# Altium schematic sheet triac.SchDoc
size A4; SheetNumber: 2; SheetTotal: 3
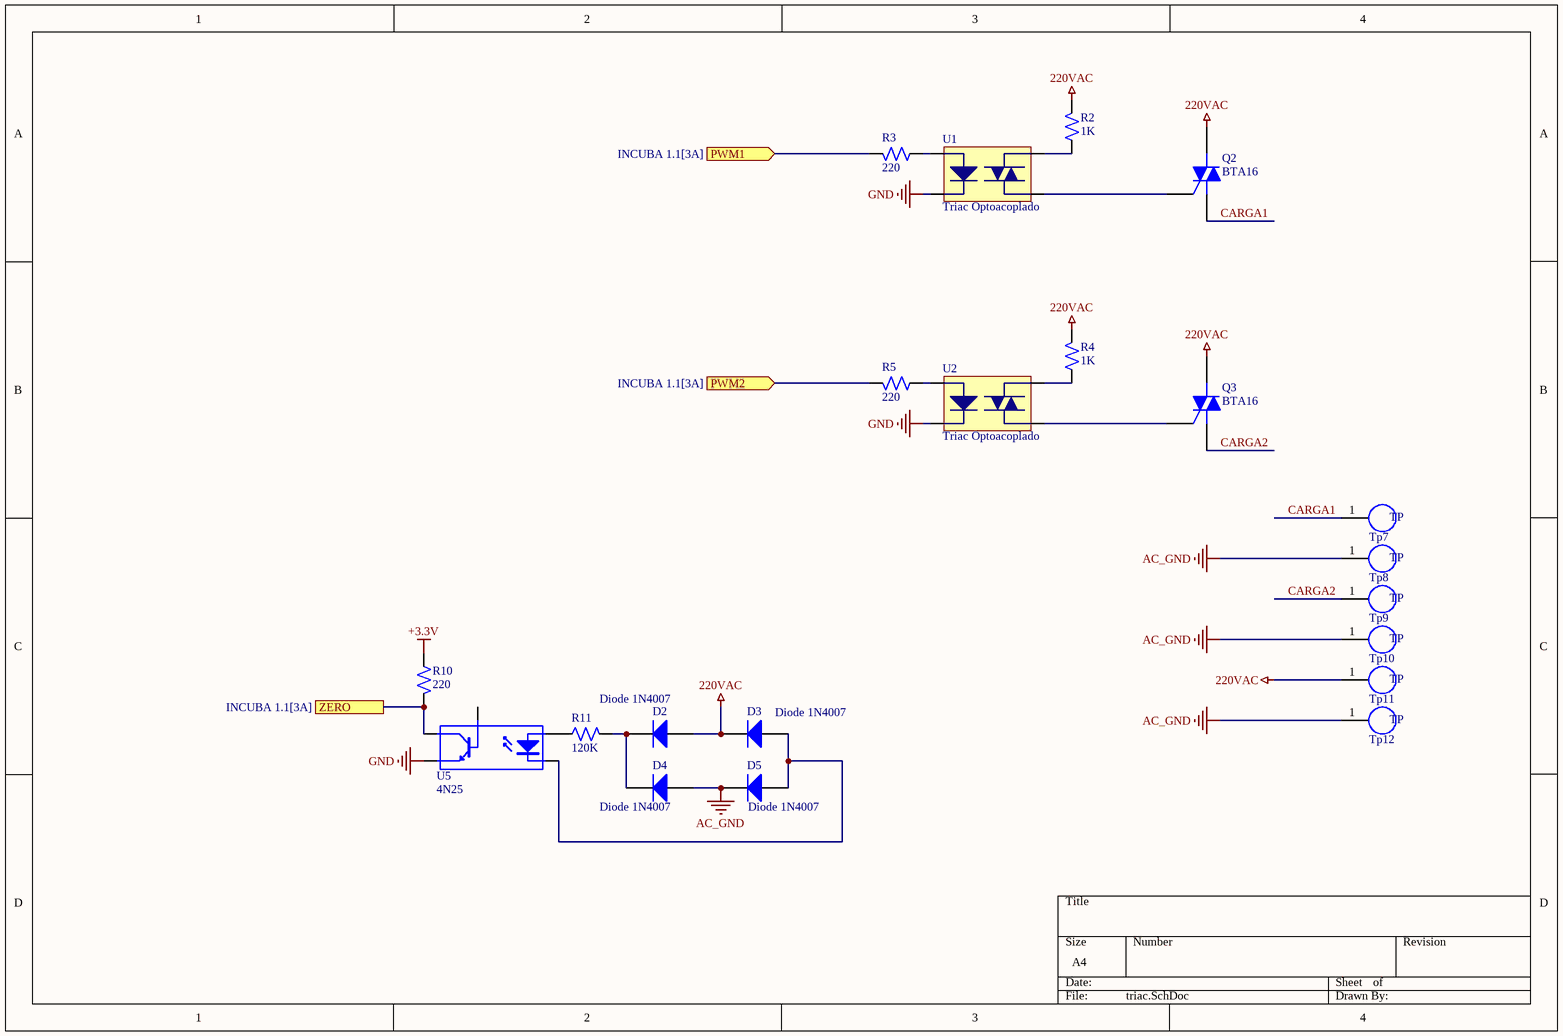
[diagram p0: triac.SchDoc]

## Parts
D2  Diode 1N4007  [DO-214AC]
D3  Diode 1N4007  [DO-214AC]
D4  Diode 1N4007  [DO-214AC]
D5  Diode 1N4007  [DO-214AC]
Q2  BTA16  [TO-220]
Q3  BTA16  [TO-220]
R2  value 1K  [0805]  (hidden comment: Resistencia)
R3  value 220  [0805]  (hidden comment: Resistencia)
R4  value 1K  [0805]  (hidden comment: Resistencia)
R5  value 220  [0805]  (hidden comment: Resistencia)
R10  value 220  [0805]  (hidden comment: Resistencia)
R11  value 120K  [0805]  (hidden comment: Resistencia)
Tp7  Testpoint  [Testpoint]  (value not drawn)
Tp8  Testpoint  [Testpoint]  (value not drawn)
Tp9  Testpoint  [Testpoint]  (value not drawn)
Tp10  Testpoint  [Testpoint]  (value not drawn)
Tp11  Testpoint  [Testpoint]  (value not drawn)
Tp12  Testpoint  [Testpoint]  (value not drawn)
U1  Triac Optoacoplado  [DIP6]
U2  Triac Optoacoplado  [DIP6]
U5  4N25  [DIP6]

## Ports
PWM1 (in, see INCUBA 1.1[3A]), PWM2 (in, see INCUBA 1.1[3A]), ZERO (see INCUBA 1.1[3A])

## Nets
220VAC: D2.1(A) D3.2(K) Q2.2(M2) Q3.2(M2) R2.2 R4.2 Tp11.1(TP)
+3.3V: R10.1
AC_GND: D4.1(A) D5.2(K) Tp8.1(TP) Tp10.1(TP) Tp12.1(TP)
GND: U1.2 U2.2 U5.4(E)
CARGA1: Q2.1(M1) Tp7.1(TP)
CARGA2: Q3.1(M1) Tp9.1(TP)
PWM1: R3.2 ; port PWM1
PWM2: R5.2 ; port PWM2
ZERO: R10.2 U5.5(C) ; port ZERO
NetD2_2: D2.2(K) D4.2(K) R11.2
NetD3_1: D3.1(A) D5.1(A) U5.2(K)
NetQ2_3: Q2.3(G) U1.4
NetQ3_3: Q3.3(G) U2.4
NetR2_1: R2.1 U1.6
NetR3_1: R3.1 U1.1
NetR4_1: R4.1 U2.6
NetR5_1: R5.1 U2.1
NetR11_1: R11.1 U5.1(A)

Not connected (* = marked no-connect by the designer): U5 6(B)

## Library data of the parts
D2-D5 = Diode 1N4007: 1 Amp General Purpose Rectifier; Published: 8-Jun-2000; LatestRevisionDate: 17-Jul-2002; LatestRevisionNote: Re-released for DXP Platform.; DatasheetVersion: 1998; PackageVersion: Aug-1999; PackageReference: DO-41; Publisher: Altium Limited; PackageDescription: Diode, Axial; Body 5.2 x 2.7 mm (LxDia. max), Lead Dia. 0.86 mm (max); Code_JEDEC: DO-204-AL; ComponentLink1Description: Manufacturer Link; ComponentLink1URL: http://www.fairchildsemi.com/; ComponentLink2Description: Datasheet; ComponentLink2URL: http://www.fairchildsemi.com/ds/1N%2F1N4001.pdf
Q2 Q3 = BTA41600B: Triac (40 Amps 600V)
R2-R5 R10 R11 = Resistencia: Resistencia  de con varios Footprint
Tp7-Tp12 = Testpoint: Tespoint
U1 U2 = MOC3040
U5 = 4N25: 5 Pin Mini Flat Pack Optocoupler; Published: 24-Mar-1999; LatestRevisionDate: 04-Mar-2005; LatestRevisionNote: PCB Footprint replaced, Sch pins re-numbered.; DatasheetVersion: Apr-2004; PackageReference: SOP5(6); Publisher: Altium Limited; PackageDescription: Small Outline; 6 Leads (1 Absent); Body Width 4.4 mm; Pitch 1.27 mm